# Altium schematic sheet SH12 - OMAP-L137 GND.SchDoc
size 386 x 246 mm
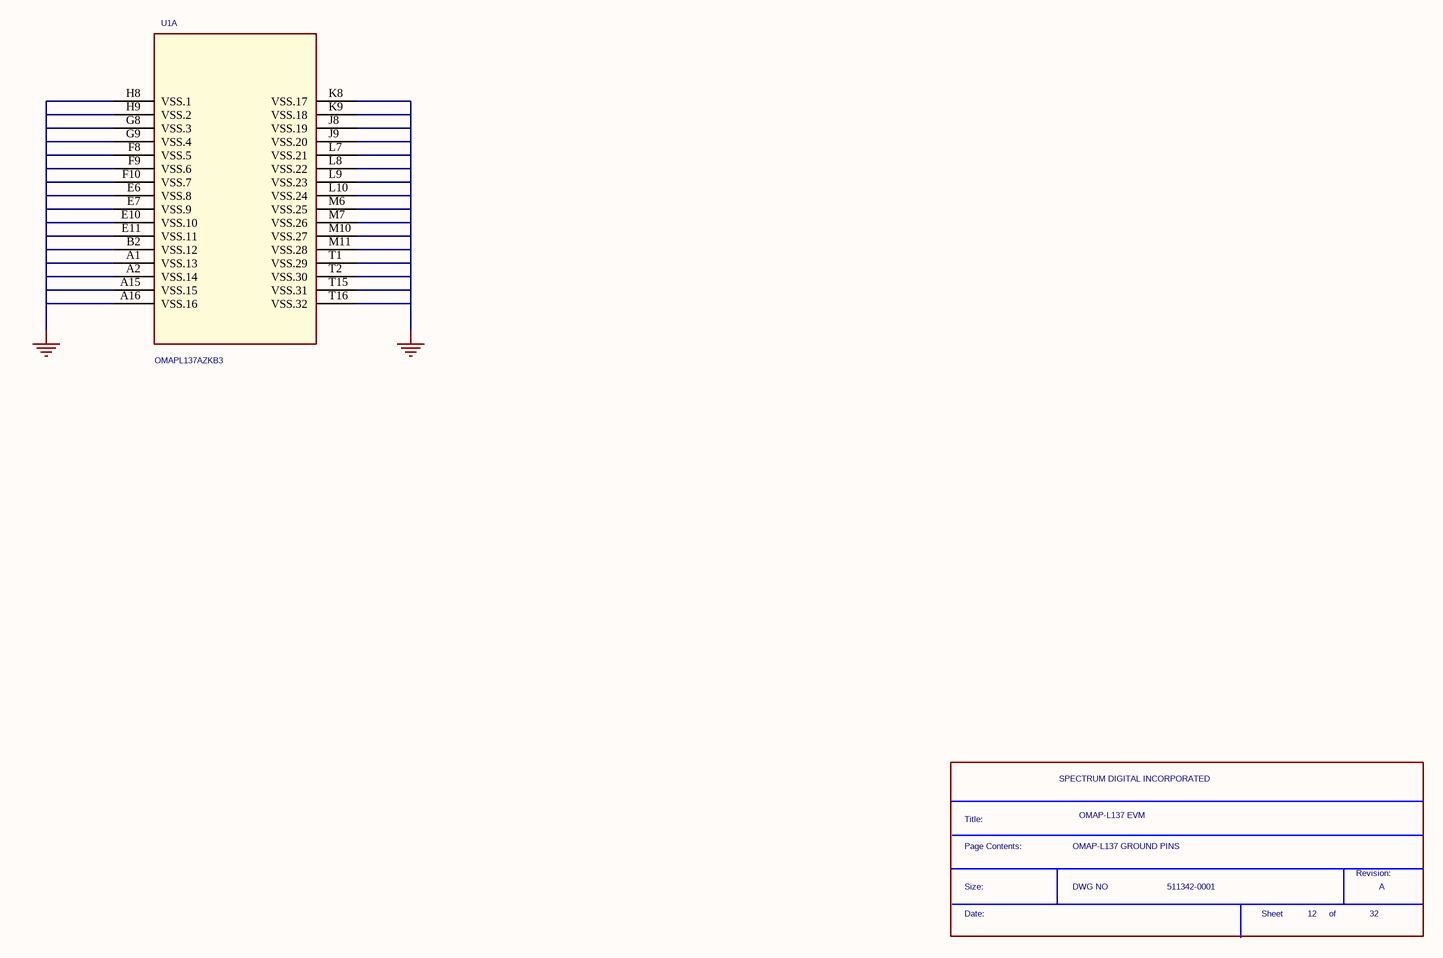
[diagram p0: SH12 - OMAP-L137 GND.SchDoc]

## Parts
*  Page Contents:: OMAP-L137 GROUND PINS  RevCode: A  Title: OMAP-L137 EVM  OrgName: SPECTRUM DIGITAL INCORPORATED  Doc: 511342-0001  Page Number: 12  Page Count: 32  (hidden comment: SDTitleBlock)  (graphical)
U1  OMAPL137AZKB3  [skt256-6064]  (part A of 9)

## Nets
GND: U1.A1(VSS.13) U1.A2(VSS.14) U1.A15(VSS.15) U1.A16(VSS.16) U1.B2(VSS.12) U1.E6(VSS.8) U1.E7(VSS.9) U1.E10(VSS.10) U1.E11(VSS.11) U1.F8(VSS.5) U1.F9(VSS.6) U1.F10(VSS.7) U1.G8(VSS.3) U1.G9(VSS.4) U1.H8(VSS.1) U1.H9(VSS.2) U1.J8(VSS.19) U1.J9(VSS.20) U1.K8(VSS.17) U1.K9(VSS.18) U1.L7(VSS.21) U1.L8(VSS.22) U1.L9(VSS.23) U1.L10(VSS.24) U1.M6(VSS.25) U1.M7(VSS.26) U1.M10(VSS.27) U1.M11(VSS.28) U1.T1(VSS.29) U1.T2(VSS.30) U1.T15(VSS.31) U1.T16(VSS.32)

## Notes on the sheet
- (in symbol SDTitleBlock) Title:; Page Contents:; Revision:; Size:; DWG NO; Date:; Sheet; of

## Library data of the parts
U1 = PRIMUS_BGA_1: Part #: 102772-0001; SWAP_INFO: (S1+S2+S3+S4+S5+S6+S7+S8+S9); SPLIT_INST: TRUE